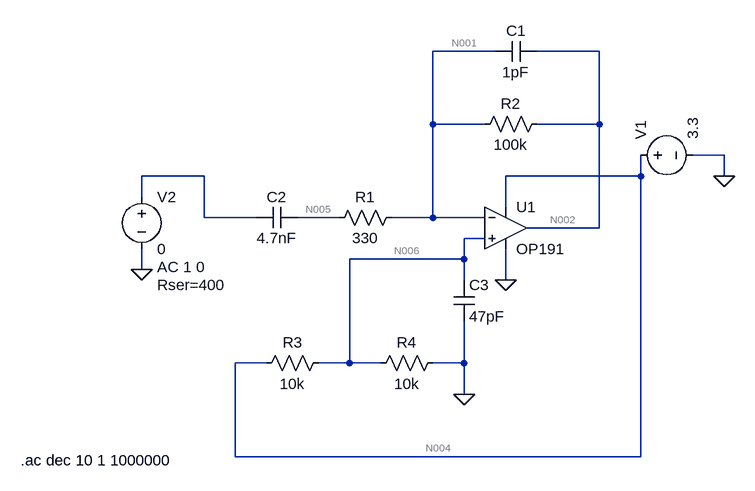
[diagram p0: schematic mic_sim.asc]
mic_sim.asc, the LTspice schematic file:
Version 4
SHEET 1 1536 680
WIRE 848 -16 752 -16
WIRE 1008 -16 912 -16
WIRE 752 96 752 -16
WIRE 832 96 752 96
WIRE 1008 96 1008 -16
WIRE 1008 96 912 96
WIRE 1200 144 1152 144
WIRE 400 176 304 176
WIRE 1072 176 1072 144
WIRE 1072 176 864 176
WIRE 1200 176 1200 144
WIRE 304 208 304 176
WIRE 864 224 864 176
WIRE 400 240 400 176
WIRE 480 240 400 240
WIRE 608 240 544 240
WIRE 752 240 752 96
WIRE 752 240 688 240
WIRE 832 240 752 240
WIRE 1008 256 1008 96
WIRE 1008 256 896 256
WIRE 832 272 800 272
WIRE 800 304 800 272
WIRE 800 304 624 304
WIRE 304 320 304 288
WIRE 800 336 800 304
WIRE 864 336 864 288
WIRE 496 464 448 464
WIRE 624 464 624 304
WIRE 624 464 576 464
WIRE 672 464 624 464
WIRE 800 464 800 400
WIRE 800 464 752 464
WIRE 800 512 800 464
WIRE 448 608 448 464
WIRE 1072 608 1072 176
WIRE 1072 608 448 608
FLAG 800 512 0
FLAG 864 336 0
FLAG 1200 176 0
FLAG 304 320 0
SYMBOL res 704 224 R90
WINDOW 0 0 56 VBottom 2
WINDOW 3 32 56 VTop 2
SYMATTR InstName R1
SYMATTR Value 330
SYMBOL res 928 80 R90
WINDOW 0 0 56 VBottom 2
WINDOW 3 32 56 VTop 2
SYMATTR InstName R2
SYMATTR Value 100k
SYMBOL res 592 448 R90
WINDOW 0 0 56 VBottom 2
WINDOW 3 32 56 VTop 2
SYMATTR InstName R3
SYMATTR Value 10k
SYMBOL res 768 448 R90
WINDOW 0 0 56 VBottom 2
WINDOW 3 32 56 VTop 2
SYMATTR InstName R4
SYMATTR Value 10k
SYMBOL cap 544 224 R90
WINDOW 0 0 32 VBottom 2
WINDOW 3 32 32 VTop 2
SYMATTR InstName C2
SYMATTR Value 4.7nF
SYMBOL cap 784 336 R0
SYMATTR InstName C3
SYMATTR Value 47pF
SYMBOL OpAmps\\OP191 864 192 R0
SYMATTR InstName U1
SYMBOL voltage 1056 144 R270
WINDOW 123 0 0 Left 0
WINDOW 39 0 0 Left 0
SYMATTR InstName V1
SYMATTR Value 3.3
SYMBOL voltage 304 192 R0
WINDOW 123 24 124 Left 2
WINDOW 39 24 152 Left 2
SYMATTR InstName V2
SYMATTR Value 0
SYMATTR Value2 AC 1 0
SYMATTR SpiceLine Rser=400
SYMBOL cap 912 -32 R90
WINDOW 0 0 32 VBottom 2
WINDOW 3 32 32 VTop 2
SYMATTR InstName C1
SYMATTR Value 1pF
TEXT 118 614 Left 2 !.ac dec 10 1 1000000

The netlist it stands for:
* mic_sim.asc
R1 N001 N005 330
R2 N002 N001 100k
R3 N006 N004 10k
R4 0 N006 10k
C2 N005 N003 4.7nF
C3 N006 0 47pF
XU1 N006 N001 N004 0 N002 OP191  ; pins In+ In- V+ V- OUT
V1 N004 0 3.3
V2 N003 0 0 AC 1 0 Rser=400
C1 N002 N001 1pF
.ac dec 10 1 1000000
.lib ADI.lib
.backanno
.end

* Results of the author's LTspice run, read from the files saved beside the schematic
* Operating Point, zero values left out:
*   V(n001) = 1.65 V
*   V(n005) = 1.65 V
*   V(n002) = 1.647 V
*   V(n006) = 1.65 V
*   V(n004) = 3.3 V
*   I(R4) = -165 µA
*   I(R3) = -165 µA
*   I(R2) = -30.05 nA
*   I(V1) = -394.8 µA
*   Ix(u1:1) = -29.95 nA
*   Ix(u1:2) = -30.05 nA
*   Ix(u1:99) = 229.8 µA
*   Ix(u1:50) = -229.8 µA
*   Ix(u1:45) = 30.05 nA
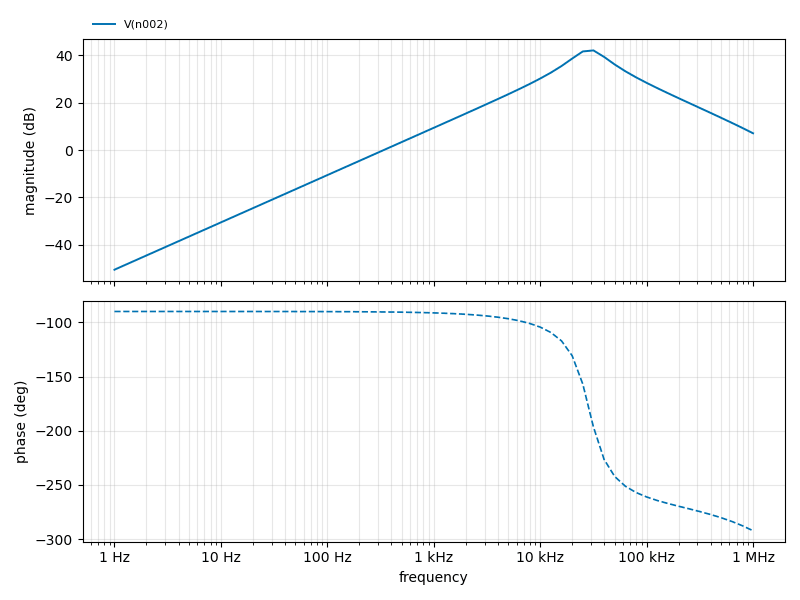
[diagram p1: AC Analysis of mic_sim.asc, plotted from the saved traces]
* AC Analysis, 1 run:
*   V(n002): -50.59 dB at 1 Hz, 7.11 dB at 1 MHz, peak 42.15 dB at 31.62 kHz, 3 dB below the peak at 20.66 kHz and 40.58 kHz